# Altium schematic sheet AD936X.SchDoc
size A4
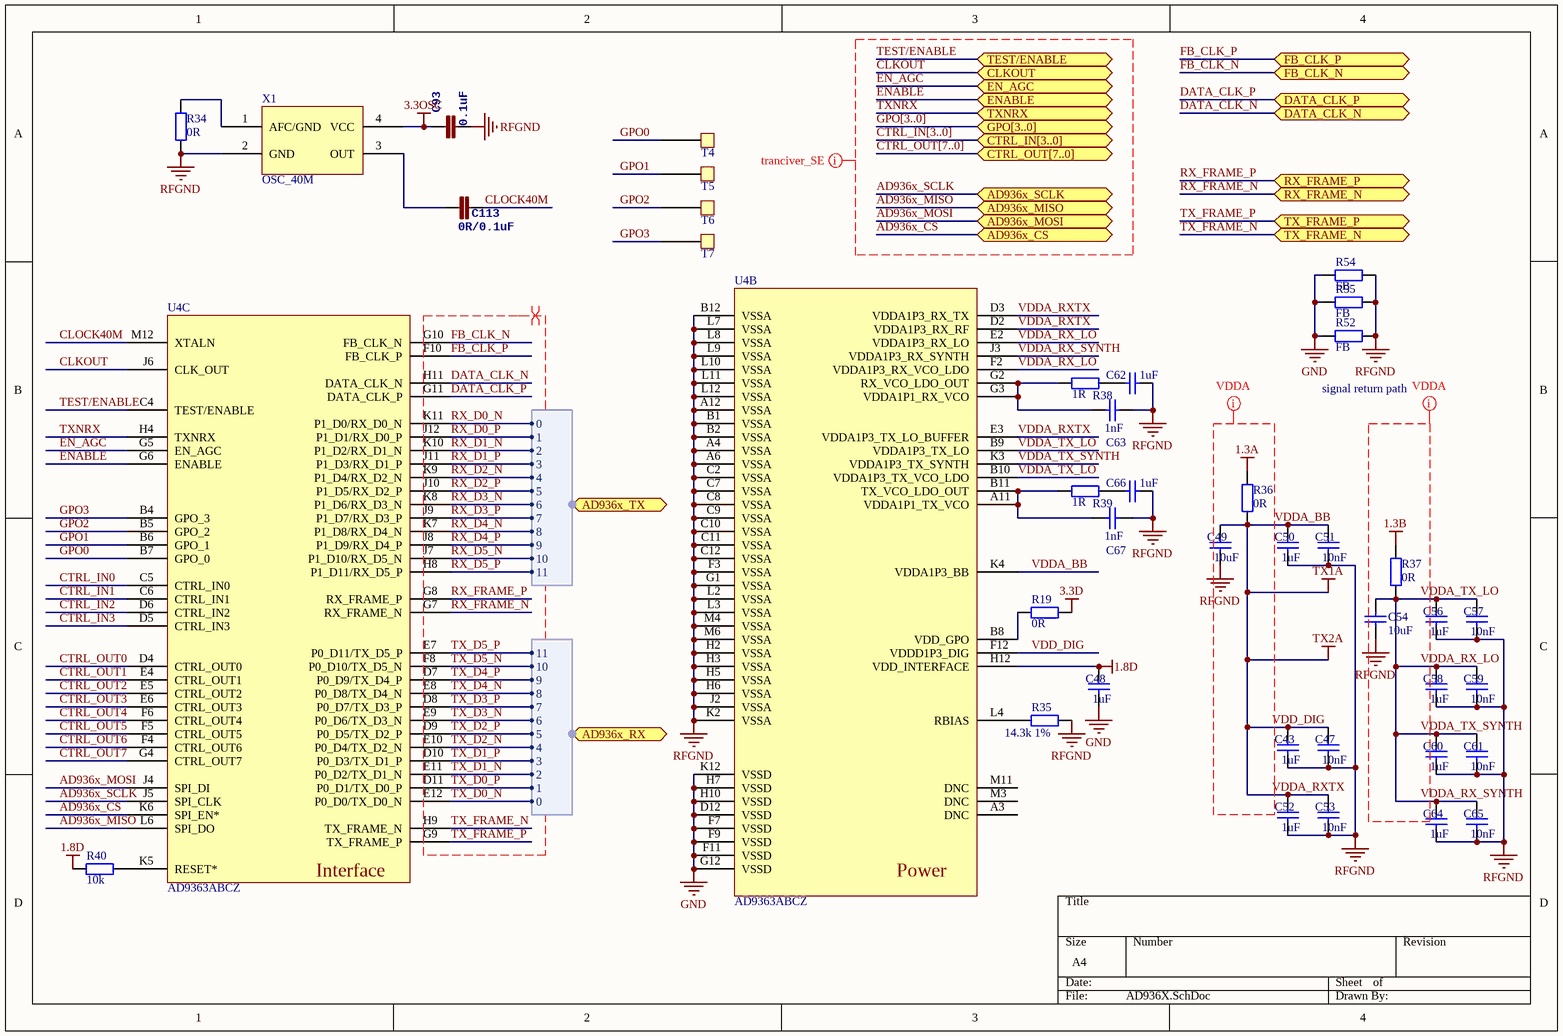
[diagram p0: AD936X.SchDoc]

## Parts
C43  1uF  [0402]
C47  10nF  [0402]
C48  1uF  [0402]
C49  10uF  [0805]
C50  1uF  [0402]
C51  10nF  [0402]
C52  1uF  [0402]
C53  10nF  [0402]
C54  10uF  [0805]
C56  1uF  [0402]
C57  10nF  [0402]
C58  1uF  [0402]
C59  10nF  [0402]
C60  1uF  [0402]
C61  10nF  [0402]
C62  1uF  [0402]
C63  1nF  [0402]
C64  1uF  [0402]
C65  10nF  [0402]
C66  1uF  [0402]
C67  1nF  [0402]
C93  0.1uF  [0402]
C113  0R/0.1uF  [0402]
R19  0R  [0402]
R34  0R  [0402]
R35  14.3k 1%  [0603]
R36  0R  [0603]
R37  0R  [0603]
R38  1R  [0402]
R39  1R  [0402]
R40  10k  [0402]
R52  FB  [0402]
R54  FB  [0402]
R55  FB  [0402]
T4  TestPad  [TestPad - 1mm]  (value not drawn)
T5  TestPad  [TestPad - 1mm]  (value not drawn)
T6  TestPad  [TestPad - 1mm]  (value not drawn)
T7  TestPad  [TestPad - 1mm]  (value not drawn)
U4  AD9363ABCZ  [AD936X]  (parts B,C of 3)
X1  OSC_40M  [TXC_7Q]

## Ports
AD936x_CS, AD936x_MISO, AD936x_MOSI, AD936x_RX (harness Harness), AD936x_SCLK, AD936x_TX (harness Harness), CLKOUT, CTRL_IN[3..0], CTRL_OUT[7..0], DATA_CLK_N, DATA_CLK_P, EN_AGC, ENABLE, FB_CLK_N, FB_CLK_P, GPO[3..0], RX_FRAME_N, RX_FRAME_P, TEST/ENABLE, TX_FRAME_N, TX_FRAME_P, TXNRX

## Harnesses
Harness: 0, 1, 2, 3, 4, 5, 6, 7, 8, 9, 10, 11

## Nets
1.3A: R36.1
1.3B: R37.1
1.8D: C48.1 R40.2 U4.H12(VDD_INTERFACE)
3.3D: R19.2
3.3OSC: C93.1 X1.4(VCC)
GND: C48.2 R52.2 R54.2 R55.2 U4.D12(VSSD) U4.F7(VSSD) U4.F9(VSSD) U4.F11(VSSD) U4.G12(VSSD) U4.H7(VSSD) U4.H10(VSSD) U4.K12(VSSD)
RFGND: C43.2 C47.2 C49.2 C50.2 C51.2 C52.2 C53.2 C54.1 C56.2 C57.2 C58.2 C59.2 C60.2 C61.2 C62.2 C63.2 C64.2 C65.2 C66.2 C67.2 C93.2 R34.2 R35.2 R52.1 R54.1 R55.1 U4.A4(VSSA) U4.A6(VSSA) U4.A12(VSSA) U4.B1(VSSA) U4.B2(VSSA) U4.B12(VSSA) U4.C2(VSSA) U4.C7(VSSA) U4.C8(VSSA) U4.C9(VSSA) U4.C10(VSSA) U4.C11(VSSA) U4.C12(VSSA) U4.F3(VSSA) U4.G1(VSSA) U4.H2(VSSA) U4.H3(VSSA) U4.H5(VSSA) U4.H6(VSSA) U4.J2(VSSA) U4.K2(VSSA) U4.L2(VSSA) U4.L3(VSSA) U4.L7(VSSA) U4.L8(VSSA) U4.L9(VSSA) U4.L10(VSSA) U4.L11(VSSA) U4.L12(VSSA) U4.M4(VSSA) U4.M6(VSSA) X1.2(GND)
VDD_DIG: C43.1 C47.1 C49.1 C50.1 C51.1 C52.1 C53.1 R36.2 U4.D2(VDDA1P3_RX_RF) U4.D3(VDDA1P3_RX_TX) U4.E3(VDDA1P3_TX_LO_BUFFER) U4.F12(VDDD1P3_DIG) U4.K4(VDDA1P3_BB)  [also labelled TX1A, TX2A, VDDA_BB, VDDA_RXTX]
AD936x_CS: U4.K6(SPI_EN*) ; port AD936x_CS
AD936x_MISO: U4.L6(SPI_DO) ; port AD936x_MISO
AD936x_MOSI: U4.J4(SPI_DI) ; port AD936x_MOSI
AD936x_SCLK: U4.J5(SPI_CLK) ; port AD936x_SCLK
CLKOUT: U4.J6(CLK_OUT) ; port CLKOUT
CLOCK40M: C113.2 U4.M12(XTALN)
CTRL_IN0: U4.C5(CTRL_IN0)
CTRL_IN1: U4.C6(CTRL_IN1)
CTRL_IN2: U4.D6(CTRL_IN2)
CTRL_IN3: U4.D5(CTRL_IN3)
CTRL_OUT0: U4.D4(CTRL_OUT0)
CTRL_OUT1: U4.E4(CTRL_OUT1)
CTRL_OUT2: U4.E5(CTRL_OUT2)
CTRL_OUT3: U4.E6(CTRL_OUT3)
CTRL_OUT4: U4.F6(CTRL_OUT4)
CTRL_OUT5: U4.F5(CTRL_OUT5)
CTRL_OUT6: U4.F4(CTRL_OUT6)
CTRL_OUT7: U4.G4(CTRL_OUT7)
DATA_CLK_N: U4.H11(DATA_CLK_N) ; port DATA_CLK_N
DATA_CLK_P: U4.G11(DATA_CLK_P) ; port DATA_CLK_P
EN_AGC: U4.G5(EN_AGC) ; port EN_AGC
ENABLE: U4.G6(ENABLE) ; port ENABLE
FB_CLK_N: U4.G10(FB_CLK_N) ; port FB_CLK_N
FB_CLK_P: U4.F10(FB_CLK_P) ; port FB_CLK_P
GPO0: T4.1 U4.B7(GPO_0)
GPO1: T5.1 U4.B6(GPO_1)
GPO2: T6.1 U4.B5(GPO_2)
GPO3: T7.1 U4.B4(GPO_3)
RX_D0_N: U4.K11(P1_D0/RX_D0_N) ; port AD936x_TX.0
RX_D0_P: U4.J12(P1_D1/RX_D0_P) ; port AD936x_TX.1
RX_D1_N: U4.K10(P1_D2/RX_D1_N) ; port AD936x_TX.2
RX_D1_P: U4.J11(P1_D3/RX_D1_P) ; port AD936x_TX.3
RX_D2_N: U4.K9(P1_D4/RX_D2_N) ; port AD936x_TX.4
RX_D2_P: U4.J10(P1_D5/RX_D2_P) ; port AD936x_TX.5
RX_D3_N: U4.K8(P1_D6/RX_D3_N) ; port AD936x_TX.6
RX_D3_P: U4.J9(P1_D7/RX_D3_P) ; port AD936x_TX.7
RX_D4_N: U4.K7(P1_D8/RX_D4_N) ; port AD936x_TX.8
RX_D4_P: U4.J8(P1_D9/RX_D4_P) ; port AD936x_TX.9
RX_D5_N: U4.J7(P1_D10/RX_D5_N) ; port AD936x_TX.10
RX_D5_P: U4.H8(P1_D11/RX_D5_P) ; port AD936x_TX.11
RX_FRAME_N: U4.G7(RX_FRAME_N) ; port RX_FRAME_N
RX_FRAME_P: U4.G8(RX_FRAME_P) ; port RX_FRAME_P
TEST/ENABLE: U4.C4(TEST/ENABLE) ; port TEST/ENABLE
TX_D0_N: U4.E12(P0_D0/TX_D0_N) ; port AD936x_RX.0
TX_D0_P: U4.D11(P0_D1/TX_D0_P) ; port AD936x_RX.1
TX_D1_N: U4.E11(P0_D2/TX_D1_N) ; port AD936x_RX.2
TX_D1_P: U4.D10(P0_D3/TX_D1_P) ; port AD936x_RX.3
TX_D2_N: U4.E10(P0_D4/TX_D2_N) ; port AD936x_RX.4
TX_D2_P: U4.D9(P0_D5/TX_D2_P) ; port AD936x_RX.5
TX_D3_N: U4.E9(P0_D6/TX_D3_N) ; port AD936x_RX.6
TX_D3_P: U4.D8(P0_D7/TX_D3_P) ; port AD936x_RX.7
TX_D4_N: U4.E8(P0_D8/TX_D4_N) ; port AD936x_RX.8
TX_D4_P: U4.D7(P0_D9/TX_D4_P) ; port AD936x_RX.9
TX_D5_N: U4.F8(P0_D10/TX_D5_N) ; port AD936x_RX.10
TX_D5_P: U4.E7(P0_D11/TX_D5_P) ; port AD936x_RX.11
TX_FRAME_N: U4.H9(TX_FRAME_N) ; port TX_FRAME_N
TX_FRAME_P: U4.G9(TX_FRAME_P) ; port TX_FRAME_P
TXNRX: U4.H4(TXNRX) ; port TXNRX
VDDA_RX_LO: C54.2 C56.1 C57.1 C58.1 C59.1 C60.1 C61.1 C64.1 C65.1 R37.2 U4.B9(VDDA1P3_TX_LO) U4.B10(VDDA1P3_TX_VCO_LDO) U4.E2(VDDA1P3_RX_LO) U4.F2(VDDA1P3_RX_VCO_LDO) U4.J3(VDDA1P3_RX_SYNTH) U4.K3(VDDA1P3_TX_SYNTH)  [also labelled VDDA_RX_SYNTH, VDDA_TX_LO, VDDA_TX_SYNTH]
NetC62_1: C62.1 R38.1
NetC63_1: C63.1 R38.2 U4.G2(RX_VCO_LDO_OUT) U4.G3(VDDA1P1_RX_VCO)
NetC66_1: C66.1 R39.1
NetC67_1: C67.1 R39.2 U4.A11(VDDA1P1_TX_VCO) U4.B11(TX_VCO_LDO_OUT)
NetC113_1: C113.1 X1.3(OUT)
NetR19_1: R19.1 U4.B8(VDD_GPO)
NetR34_1: R34.1 X1.1(AFC/GND)
NetR35_1: R35.1 U4.L4(RBIAS)
NetR40_1: R40.1 U4.K5(RESET*)

Not connected (* = marked no-connect by the designer): U4 A3(DNC) M3(DNC) M11(DNC)

## Buses and harness runs
bus CTRL_IN[3..0] = port CTRL_IN[3..0]
bus CTRL_OUT[7..0] = port CTRL_OUT[7..0]
bus GPO[3..0] = port GPO[3..0]

## Layout directives
differential pair: DATA_CLK_N, DATA_CLK_P, FB_CLK_N, FB_CLK_P, RX_D0_N, RX_D0_P, RX_D1_N, RX_D1_P, RX_D2_N, RX_D2_P, RX_D3_N, RX_D3_P, RX_D4_N, RX_D4_P, RX_D5_N, RX_D5_P, RX_FRAME_N, RX_FRAME_P, TX_D0_N, TX_D0_P, TX_D1_N, TX_D1_P, TX_D2_N, TX_D2_P, TX_D3_N, TX_D3_P, TX_D4_N, TX_D4_P, TX_D5_N, TX_D5_P, TX_FRAME_N, TX_FRAME_P
net class VDDA: 1.3A, 1.3B, RFGND, VDD_DIG, VDDA_BB, VDDA_RX_LO, VDDA_RX_SYNTH, VDDA_RXTX, VDDA_TX_LO, VDDA_TX_SYNTH
net class tranciver_SE: AD936x_CS, AD936x_MISO, AD936x_MOSI, AD936x_SCLK, CLKOUT, CTRL_IN[3..0], CTRL_OUT[7..0], EN_AGC, ENABLE, GPO[3..0], TEST/ENABLE, TXNRX

## Notes on the sheet
- (near R52) signal return path
- (in symbol AD9363ABCZ, part B) Power
- (in symbol AD9363ABCZ, part C) Interface

## Library data of the parts
C43 C47-C54 C56-C67 = Cap: Capacitor; Published: 8-Jun-2000; LatestRevisionDate: 17-Jul-2002; LatestRevisionNote: Re-released for DXP Platform.; PackageReference: RAD-0.3; Publisher: Altium Limited; PackageDescription: Radial Cap, Thru-Hole; 2 Leads; 0.3 in Pin Spacing
C93 C113 = CAP0402-CAP: <b>Capacitor</b> / Standard 0603 ceramic capacitor, and 0.1" leaded capacitor.; PARTNO: CC0402ZRY5V7BB104
R19 R34-R40 R52 R54 R55 = Res2: Resistor; Value: 0Ohm; Published: 8-Jun-2000; LatestRevisionDate: 17-Jul-2002; LatestRevisionNote: Re-released for DXP Platform.; PackageReference: AXIAL-0.4; Publisher: Altium Limited; PackageDescription: Axial Device, Thru-Hole; 2 Leads; 0.4 in Pin Spacing
U4 = AD9363ABCZ: Imported; Value: Value; Type: Type; RefDes: RefDes